# EAGLE design extension-board (EAGLE 6.4)
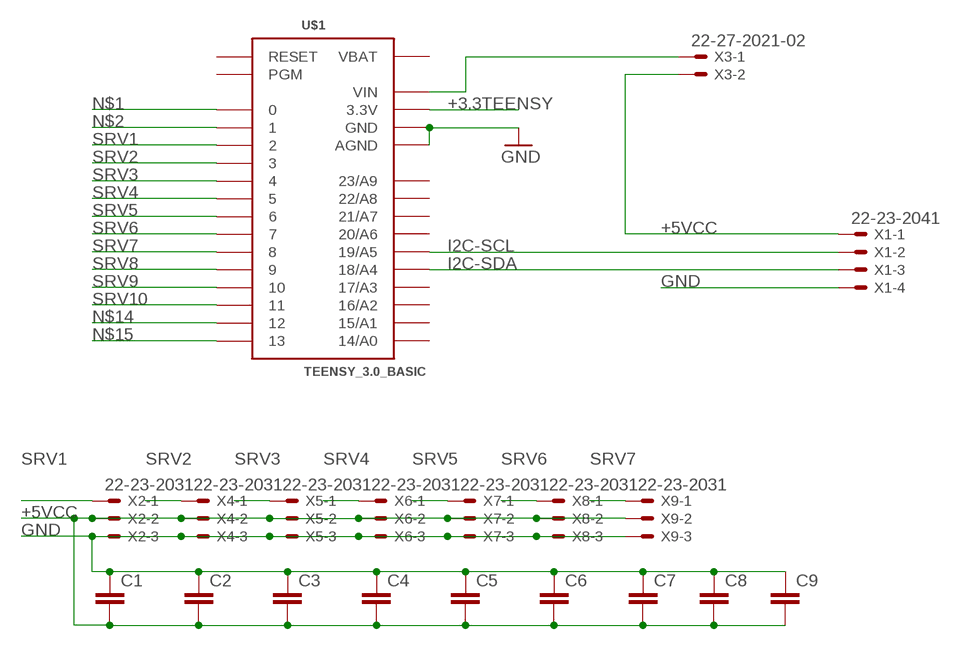
[diagram p0: schematic, sheet 1]

## Parts
C1  C-EUC0805K  [C0805K]
C2  C-EUC0805K  [C0805K]
C3  C-EUC0805K  [C0805K]
C4  C-EUC0805K  [C0805K]
C5  C-EUC0805K  [C0805K]
C6  C-EUC0805K  [C0805K]
C7  C-EUC0805K  [C0805K]
C8  C-EUC0805K  [C0805K]
C9  C-EUC0805K  [C0805K]
U$1  TEENSY_3.0_BASIC  [TEENSY_3.0_BASIC]
X1  22-23-2041  [22-23-2041]
X2  22-23-2031  [22-23-2031]
X3  22-27-2021-02  [6410-02]
X4  22-23-2031  [22-23-2031]
X5  22-23-2031  [22-23-2031]
X6  22-23-2031  [22-23-2031]
X7  22-23-2031  [22-23-2031]
X8  22-23-2031  [22-23-2031]
X9  22-23-2031  [22-23-2031]

## Nets
+3.3TEENSY: U$1.3.3V U$1.3.3V1(3.3V)
+5VCC: C1.2 C2.2 C3.2 C4.2 C5.2 C6.2 C7.2 C8.2 C9.2 X1.1 X2.2 X3.2 X4.2 X5.2 X6.2 X7.2 X8.2 X9.2
GND: C1.1 C2.1 C3.1 C4.1 C5.1 C6.1 C7.1 C8.1 C9.1 U$1.AGND U$1.GND U$1.GND1(GND) X1.4 X2.3 X4.3 X5.3 X6.3 X7.3 X8.3 X9.3
I2C-SCL: U$1.19/A5 X1.2
I2C-SDA: U$1.18/A4 X1.3
N$1: U$1.0
N$2: U$1.1
N$3: U$1.VIN X3.1
N$14: U$1.12
N$15: U$1.13
SRV1: U$1.2 X2.1
SRV2: U$1.3 X4.1
SRV3: U$1.4 X5.1
SRV4: U$1.5 X6.1
SRV5: U$1.6 X7.1
SRV6: U$1.7 X8.1
SRV7: U$1.8 X9.1
SRV8: U$1.9
SRV9: U$1.10
SRV10: U$1.11
Unconnected: U$1.14/A0 U$1.15/A1 U$1.16/A2 U$1.17/A3 U$1.20/A6 U$1.21/A7 U$1.22/A8 U$1.23/A9 U$1.PGM U$1.RESET

## Power pins joined to a net without a drawn wire
VBAT: U$1.VBAT

## Library data of the parts
C1-C9 = rcl:C-EU: CAPACITOR, European symbol
U$1 = Teensy3.0:TEENSY_3.0_BASIC: Basic Teensy 3.0 with none of the 'inner' pins enabled. See '+4', 'AllAnalogPins", and 'AllPins' packages for additional pin holes, as needed.
X1 = con-molex:22-23-2041: .100" (2.54mm) Center Header - 4 Pin; MF: MOLEX; MPN: 22-23-2041; OC_FARNELL: 1462920; OC_NEWARK: 38C0355
X2 X4-X9 = con-molex:22-23-2031: .100" (2.54mm) Center Header - 3 Pin; MF: MOLEX; MPN: 22-23-2031; OC_FARNELL: 1462950; OC_NEWARK: 30C0862
X3 = con-molex:22-?-02: CONNECTOR wire to board 2.54 mm (.1 inch) pitch header; OC_FARNELL: unknown; OC_NEWARK: unknown

## Board
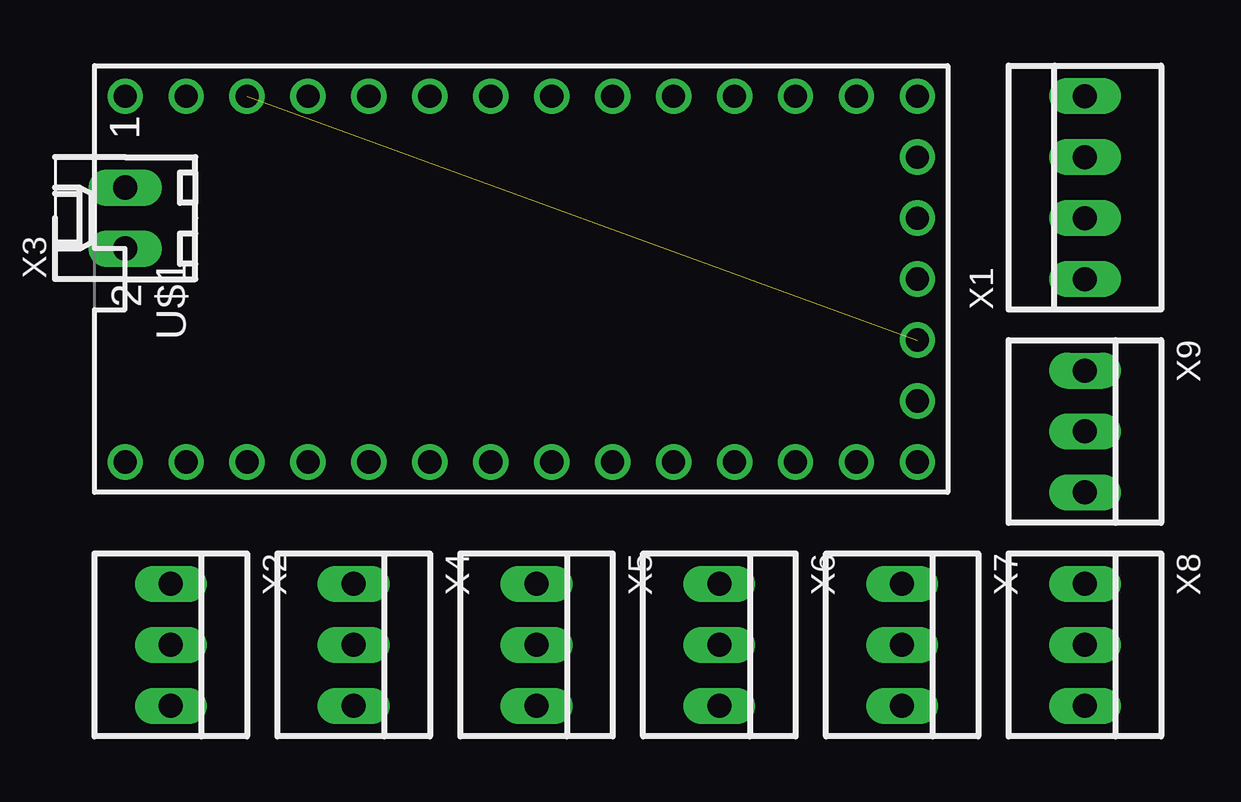
[diagram p1: board, top side]
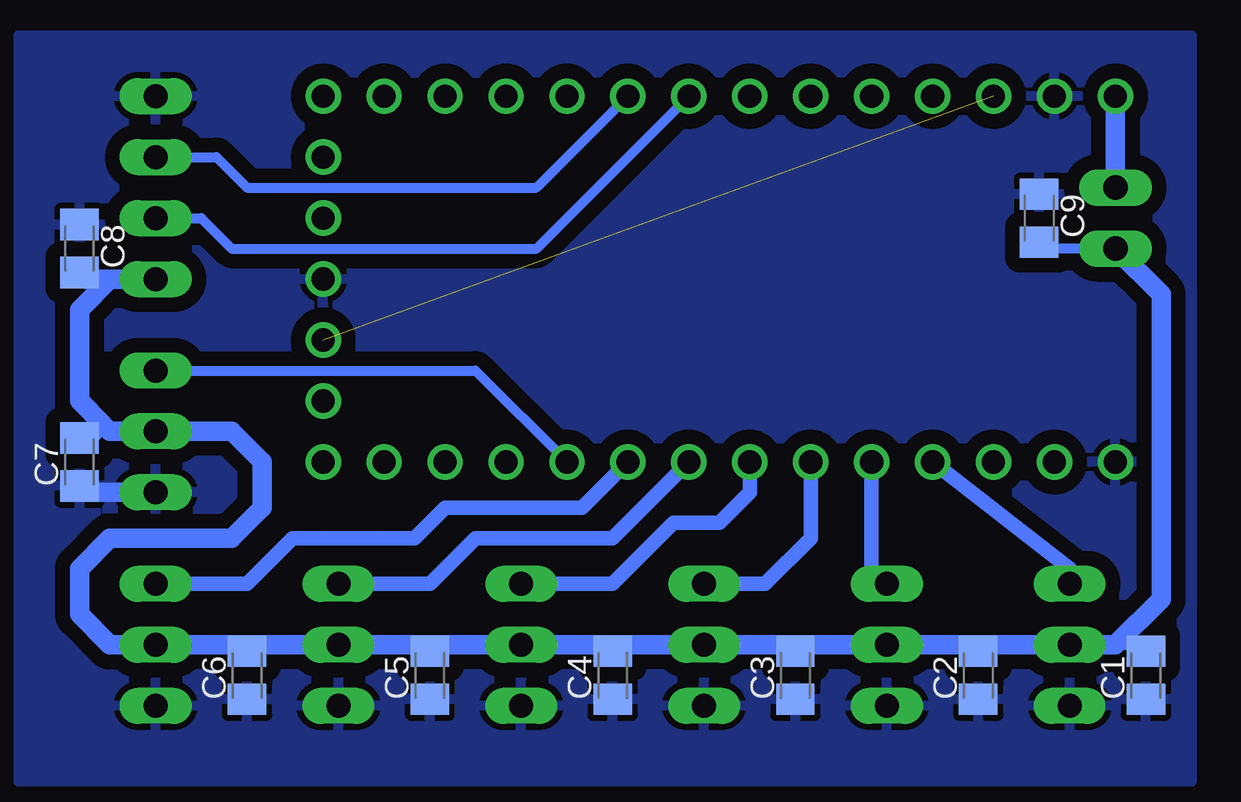
[diagram p2: board, bottom side, seen from below]

No outline drawn. Coordinates in mm, seen from the top.
Copper layers (1*16): Top 0.035mm / dielectric 1.5mm / Bottom 0.035mm
Design rules "SeeedStudio_DRU_no_angle_2layer": minimum track width 6mil, minimum drill 12mil, track to track 6mil, track to pad 6mil, pad to pad 6mil, via to via 6mil, smd to smd 0mil, copper to edge 10mil, drill to drill 10mil, minimum pad ring 10mil, minimum via ring 6mil, stop-mask expansion 2mil, vias tented up to drill 25mil, thermal gap 10mil

### Footprints (pad centres in the part's own frame; a part is rotated, then mirrored left to right if it is on the bottom)
C0805K = smd 1.3 x 1.6: 1 -1,0; 2 1,0
TEENSY_3.0_BASIC = drill 0.965: 0 -7.62,13.97; 1 -7.62,11.43; 2 -7.62,8.89; 3 -7.62,6.35; 3.3V 7.62,11.43; 3.3V1 -2.54,-16.51; 4 -7.62,3.81; 5 -7.62,1.27; 6 -7.62,-1.27; 7 -7.62,-3.81; 8 -7.62,-6.35; 9 -7.62,-8.89; 10 -7.62,-11.43; 11 -7.62,-13.97; 12 -7.62,-16.51; 13 7.62,-16.51; 14/A0 7.62,-13.97; 15/A1 7.62,-11.43; 16/A2 7.62,-8.89; 17/A3 7.62,-6.35; 18/A4 7.62,-3.81; 19/A5 7.62,-1.27; 20/A6 7.62,1.27; 21/A7 7.62,3.81; 22/A8 7.62,6.35; 23/A9 7.62,8.89; AGND 7.62,13.97; GND -7.62,16.51; GND1 0,-16.51; PGM 2.54,-16.51; RESET 5.08,-16.51; VBAT -5.08,-16.51; VIN 7.62,16.51
22-23-2041 = drill 1 long: 1 -3.81,0; 2 -1.27,0; 3 1.27,0; 4 3.81,0
22-23-2031 = drill 1 long: 1 -2.54,0; 2 0,0; 3 2.54,0
6410-02 = drill 1.016 long: 1 1.27,0; 2 -1.27,0

### Placement (x,y rotation side)
C1  1.91,4.45 90 bottom
C2  8.89,4.45 90 bottom
C3  16.51,4.45 90 bottom
C4  24.13,4.45 90 bottom
C5  31.75,4.45 90 bottom
C6  39.37,4.45 90 bottom
C7  46.35,13.34 90 bottom
C8  46.35,22.23 270 bottom
C9  6.35,23.5 270 bottom
U$1  19.68,20.95 90 top
X1  43.18,24.77 90 top
X2  5.08,5.71 270 top
X3  3.17,23.5 90 top
X4  12.7,5.71 270 top
X5  20.32,5.71 270 top
X6  27.94,5.71 270 top
X7  35.56,5.71 270 top
X8  43.18,5.71 270 top
X9  43.18,14.61 270 top

### Tracks (layer width: path | path; a pad name or v marks a point on that pad's centre or on a via)
+3.3TEENSY  (1 unrouted)
+5VCC
  Bottom 0.406: 3.17,5.71 2.17,5.71 C1.2 | X4.2 9.16,5.71 C2.2 | X5.2 16.78,5.71 C3.2 | X6.2 24.4,5.71 C4.2 | X7.2 32.02,5.71 C5.2 | X8.2 39.64,5.71 C6.2 | X3.2 6.08,22.23 C9.2
  Bottom 0.813: X3.2 1.27,20.32 1.27,7.62 3.17,5.71 X2.2 X4.2 X5.2 X6.2 X7.2 X8.2 45.09,5.71 46.35,6.99 46.35,8.89 45.09,10.16 40.01,10.16 38.73,11.43 38.73,13.34 40.01,14.61 X9.2 45.09,14.61 45.4,14.92 | 45.4,14.92 46.35,15.88 46.35,19.68 45.09,20.95 | 45.09,20.95 X1.1 | C7.2 45.99,14.34 45.4,14.92 | 45.09,20.95 46.09,20.95 C8.2
GND
  Bottom 0.813: X9.3 46.09,12.06 C7.1
  pour Bottom (isolate 0.61): 0,31.11 0,0 48.9,0 48.9,31.11
I2C-SCL
  Bottom 0.406: U$1.19/A5 27.3,22.23 40.01,22.23 41.27,23.5 X1.2
I2C-SDA
  Bottom 0.406: U$1.18/A4 27.3,24.77 39.37,24.77 40.64,26.04 X1.3
N$3
  Bottom 0.813: U$1.VIN X3.1
SRV1
  Bottom 0.61: U$1.2 5.08,8.89 X2.1
SRV2
  Bottom 0.61: U$1.3 13.34,8.89 X4.1
SRV3
  Bottom 0.61: U$1.4 15.88,10.16 17.78,8.26 X5.1
SRV4
  Bottom 0.61: U$1.5 18.41,12.06 19.68,10.79 21.59,10.79 24.13,8.26 X6.1
SRV5
  Bottom 0.61: U$1.6 24.13,10.16 29.84,10.16 31.75,8.26 X7.1
SRV6
  Bottom 0.61: U$1.7 25.4,11.43 31.11,11.43 32.38,10.16 37.47,10.16 39.37,8.26 X8.1
SRV7
  Bottom 0.406: X9.1 29.84,17.14 U$1.8